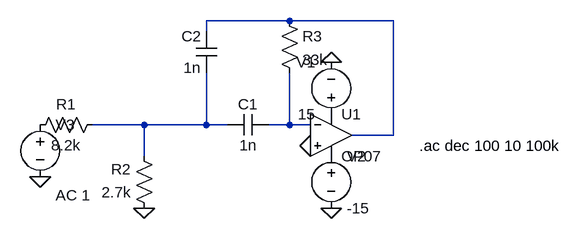
[diagram p0: schematic am-radio.asc]
am-radio.asc, the LTspice schematic file:
Version 4
SHEET 1 880 680
WIRE 160 -32 32 -32
WIRE 320 -32 160 -32
WIRE 32 -16 32 -32
WIRE -64 128 -144 128
WIRE 32 128 32 48
WIRE 32 128 -64 128
WIRE 64 128 32 128
WIRE 160 128 160 48
WIRE 160 128 128 128
WIRE 192 128 160 128
WIRE 320 144 320 -32
WIRE 320 144 256 144
WIRE -64 176 -64 128
FLAG -64 256 0
FLAG 192 160 0
FLAG 224 32 0
FLAG 224 256 0
FLAG -224 208 0
SYMBOL OpAmps\\OP07 224 80 R0
SYMATTR InstName U1
SYMBOL res -128 112 R90
WINDOW 0 0 56 VBottom 2
WINDOW 3 32 56 VTop 2
SYMATTR InstName R1
SYMATTR Value 8.2k
SYMBOL res -48 272 R180
WINDOW 0 36 76 Left 2
WINDOW 3 36 40 Left 2
SYMATTR InstName R2
SYMATTR Value 2.7k
SYMBOL res 144 -48 R0
SYMATTR InstName R3
SYMATTR Value 33k
SYMBOL cap 128 112 R90
WINDOW 0 0 32 VBottom 2
WINDOW 3 32 32 VTop 2
SYMATTR InstName C1
SYMATTR Value 1n
SYMBOL cap 48 48 R180
WINDOW 0 24 56 Left 2
WINDOW 3 24 8 Left 2
SYMATTR InstName C2
SYMATTR Value 1n
SYMBOL voltage 224 128 R180
WINDOW 0 24 96 Left 2
WINDOW 3 24 16 Left 2
WINDOW 123 0 0 Left 0
WINDOW 39 0 0 Left 0
SYMATTR InstName V1
SYMATTR Value 15
SYMBOL voltage 224 160 R0
WINDOW 123 0 0 Left 0
WINDOW 39 0 0 Left 0
SYMATTR InstName V2
SYMATTR Value -15
SYMBOL voltage -224 112 R0
WINDOW 123 24 124 Left 2
WINDOW 39 0 0 Left 0
SYMATTR InstName V3
SYMATTR Value ""
SYMATTR Value2 AC 1
TEXT 360 160 Left 2 !.ac dec 100 10 100k

The netlist it stands for:
* am-radio.asc
XU1 0 N003 P001 P002 N001 LT1001  ; OP07, pins In+ In- V+ V- OUT
R1 N002 P003 8.2k
R2 0 N002 2.7k
R3 N001 N003 33k
C1 N003 N002 1n
C2 N002 N001 1n
V1 P001 0 15
V2 P002 0 -15
V3 P003 0 AC 1
.ac dec 100 10 100k
.lib LTC.lib
.backanno
.end